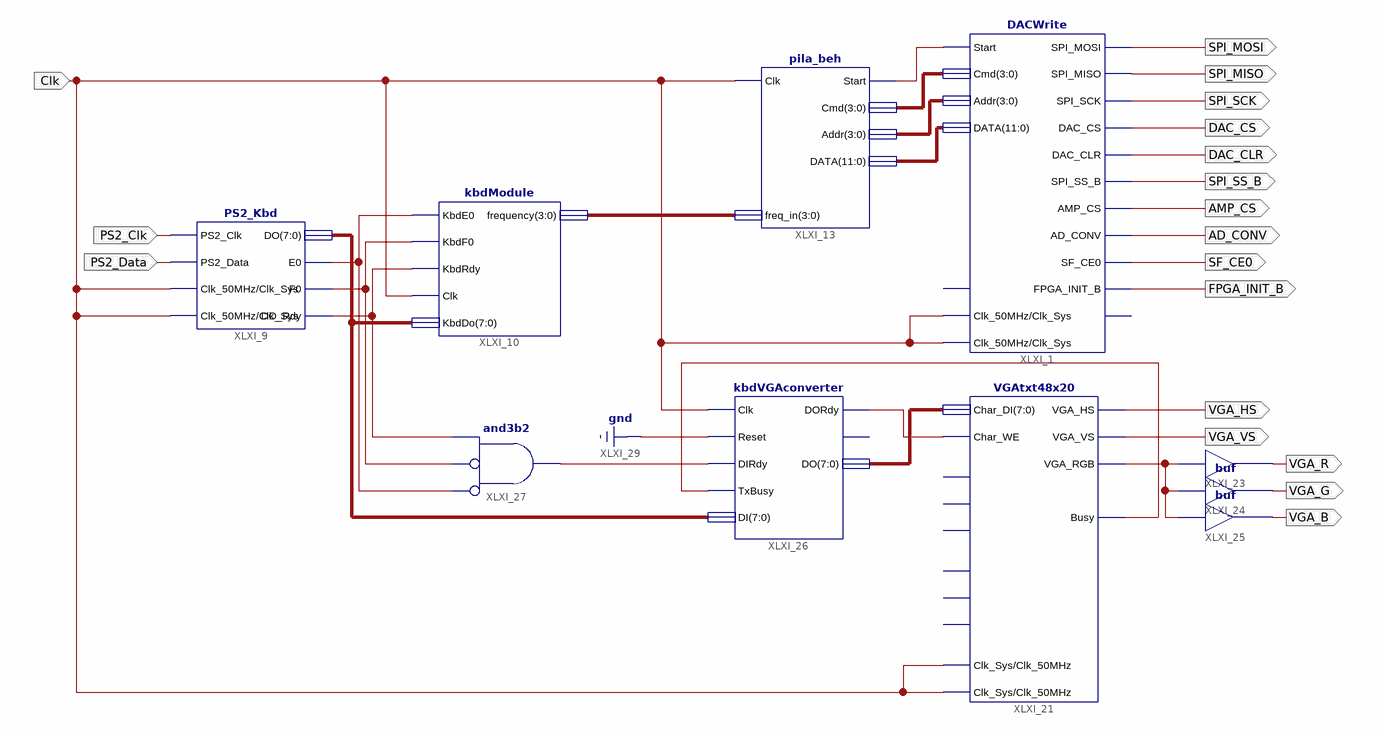
[diagram p0: schematic sheet 1]
// Xilinx ISE schematic nieTylko_dacWrite_schematic.sch (spartan3e) as structural Verilog: 10 symbols, 18 ports
module nieTylko_dacWrite_schematic (
  input  Clk,
  input  PS2_Clk,
  input  PS2_Data,
  output SPI_MISO,
  output DAC_CLR,
  output DAC_CS,
  output SPI_MOSI,
  output SPI_SCK,
  output SPI_SS_B,
  output AMP_CS,
  output AD_CONV,
  output SF_CE0,
  output FPGA_INIT_B,
  output VGA_HS,
  output VGA_VS,
  output VGA_R,
  output VGA_G,
  output VGA_B
);

  wire XLXN_1, XLXN_23, XLXN_24, XLXN_25, XLXN_36, XLXN_37, XLXN_39, XLXN_43;
  wire [3:0] XLXN_2, XLXN_3, XLXN_30;
  wire [7:0] XLXN_38, XLXN_41;
  wire [11:0] XLXN_4;

  VGAtxt48x20 XLXI_21 (
    .Char_DI(XLXN_38), .Clk_Sys(Clk), .Clk_50MHz(Clk), .Busy(XLXN_39), .VGA_HS(VGA_HS), .VGA_VS(VGA_VS),
    .VGA_RGB(XLXN_36), .Char_WE(XLXN_37));  // open: Home, NewLine, Goto00, CursorOn, ScrollEn, ScrollClear
  DACWrite XLXI_1 (
    .Start(XLXN_1), .SPI_MISO(SPI_MISO), .Cmd(XLXN_2), .Addr(XLXN_3), .DATA(XLXN_4), .DAC_CLR(DAC_CLR),
    .DAC_CS(DAC_CS), .SPI_MOSI(SPI_MOSI), .SPI_SCK(SPI_SCK), .SPI_SS_B(SPI_SS_B), .AMP_CS(AMP_CS),
    .AD_CONV(AD_CONV), .SF_CE0(SF_CE0), .FPGA_INIT_B(FPGA_INIT_B), .Clk_50MHz(Clk), .Clk_Sys(Clk));  // open: Reset, Busy
  pila_beh XLXI_13 (.Clk(Clk), .Start(XLXN_1), .Cmd(XLXN_2), .Addr(XLXN_3), .DATA(XLXN_4), .freq_in(XLXN_30));
  kbdModule XLXI_10 (
    .KbdE0(XLXN_23), .KbdF0(XLXN_24), .KbdRdy(XLXN_25), .Clk(Clk), .KbdDo(XLXN_41), .frequency(XLXN_30));
  buf XLXI_23 (VGA_R, XLXN_36);
  buf XLXI_24 (VGA_G, XLXN_36);
  buf XLXI_25 (VGA_B, XLXN_36);
  kbdVGAconverter XLXI_26 (
    .Clk(Clk), .Reset(1'b0), .DIRdy(XLXN_43), .TxBusy(XLXN_39), .DI(XLXN_41), .DORdy(XLXN_37), .DO(XLXN_38));  // open: Busy
  and XLXI_27 (XLXN_43, ~XLXN_23, ~XLXN_24, XLXN_25);  // and3b2
  PS2_Kbd XLXI_9 (
    .PS2_Clk(PS2_Clk), .PS2_Data(PS2_Data), .Clk_50MHz(Clk), .E0(XLXN_23), .F0(XLXN_24), .DO_Rdy(XLXN_25),
    .DO(XLXN_41), .Clk_Sys(Clk));
endmodule
